# Altium schematic sheet sensors.SchDoc
size A4; SheetNumber: 3; SheetTotal: 3
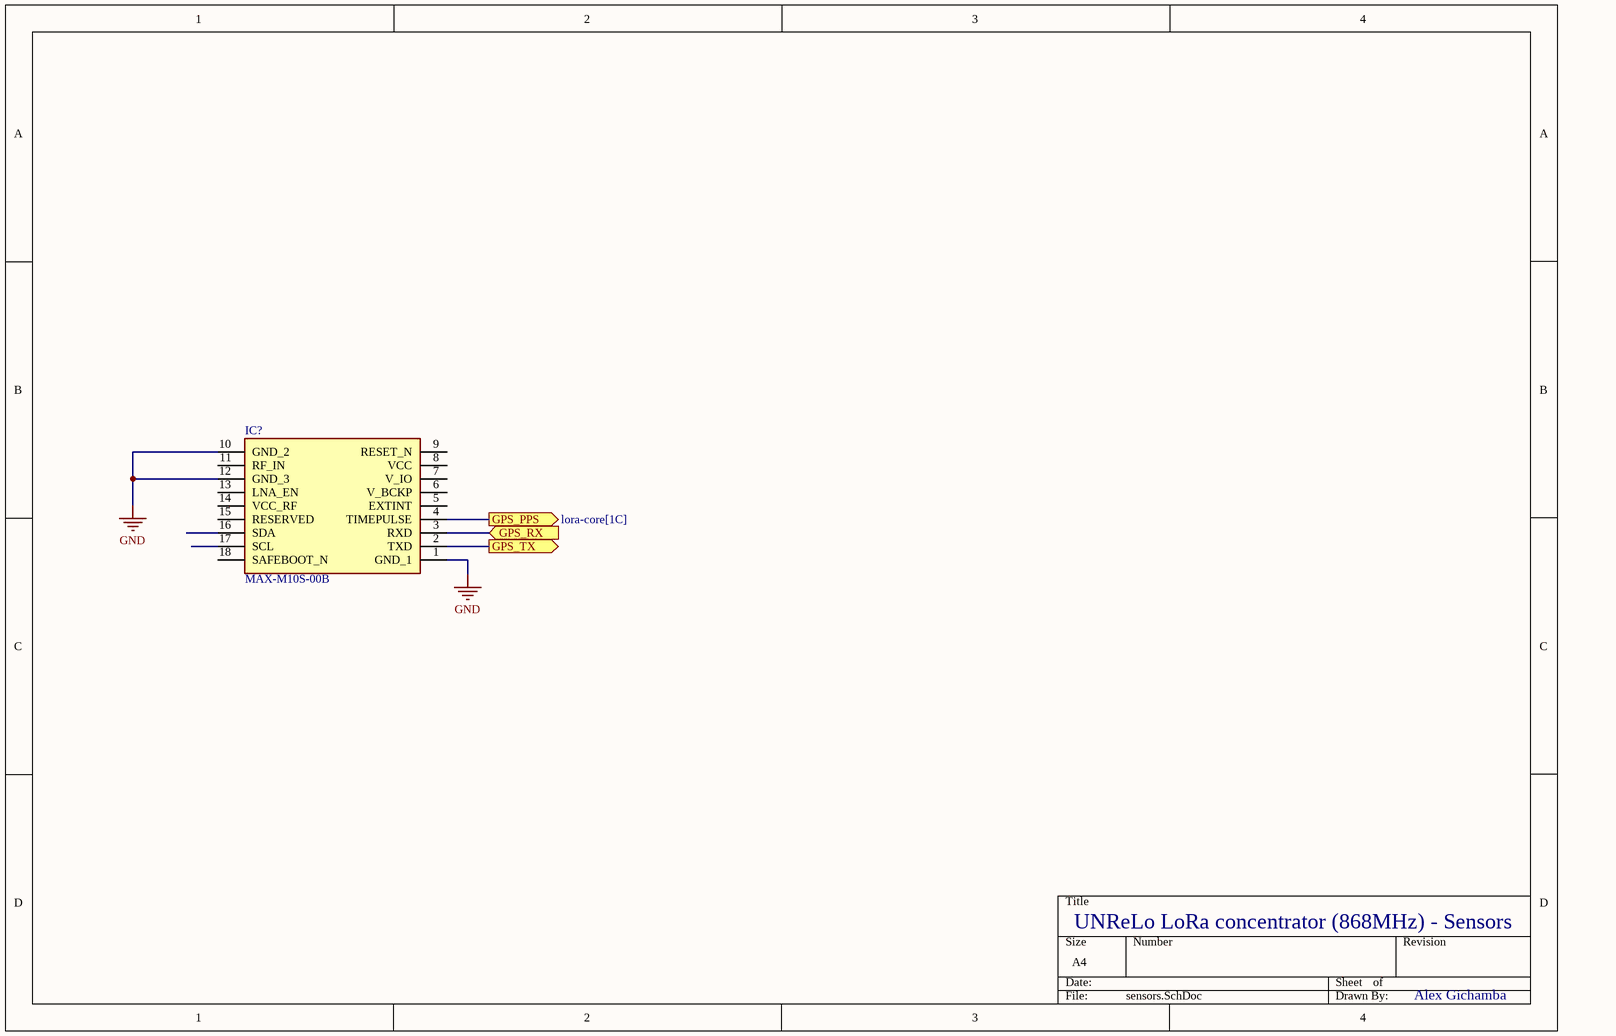
[diagram p0: sensors.SchDoc]

## Parts
IC?  MAX-M10S-00B  [MAXM10S00B]

## Ports
GPS_PPS (out, see lora-core[1C]), GPS_RX (in), GPS_TX (out)

## Nets
GND: IC?.1(GND_1) IC?.10(GND_2) IC?.12(GND_3)
GPS_PPS: IC?.4(TIMEPULSE) ; port GPS_PPS
GPS_RX: IC?.3(RXD) ; port GPS_RX
GPS_TX: IC?.2(TXD) ; port GPS_TX

Not connected (* = marked no-connect by the designer): IC? 5(EXTINT) 6(V_BCKP) 7(V_IO) 8(VCC) 9(RESET_N) 11(RF_IN) 13(LNA_EN) 14(VCC_RF) 15(RESERVED) 16(SDA) 17(SCL) 18(SAFEBOOT_N)

## Notes on the sheet
- UNReLo LoRa concentrator (868MHz) - Sensors
- Alex Gichamba

## Library data of the parts
IC? = MAX-M10S-00B: Integrated Circuit; Manufacturer_Name: U-Blox; Datasheet Link: https://content.u-blox.com/sites/default/files/MAX-M10S_IntegrationManual_UBX-20053088.pdf; Height: 2.7mm; Manufacturer_Part_Number: MAX-M10S-00B; Mouser Part Number: 377-MAX-M10S-00B; Mouser Price/Stock: https://www.mouser.co.uk/ProductDetail/u-blox/MAX-M10S-00B?qs=A6eO%252BMLsxmT0PfQYPb7LLQ%3D%3D